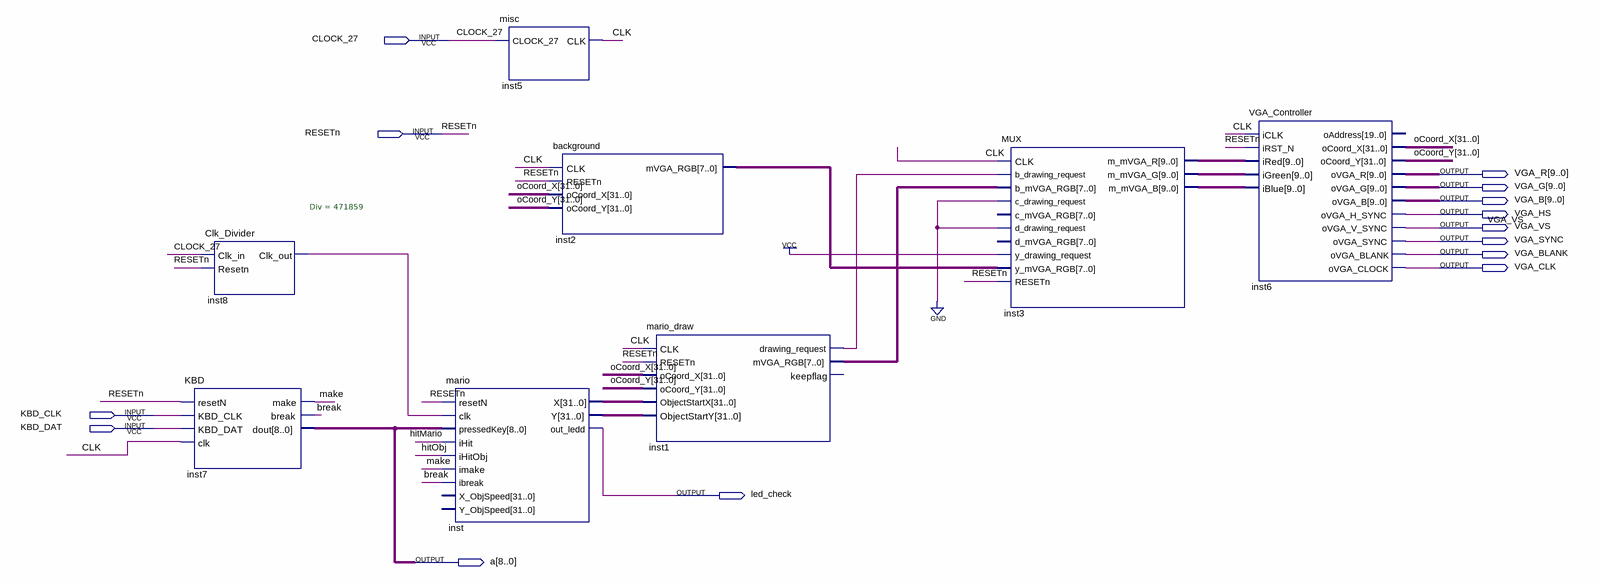
[diagram p0: schematic sheet]
// Quartus schematic SIFTAH_SUPER_MARIO.bdf as structural Verilog: 8 symbols, 14 pins
module SIFTAH_SUPER_MARIO (
  input  CLOCK_27,
  input  RESETn,
  input  KBD_CLK,
  input  KBD_DAT,
  output [9:0] VGA_R,
  output [9:0] VGA_G,
  output [9:0] VGA_B,
  output VGA_HS,
  output VGA_VS,
  output VGA_SYNC,
  output VGA_BLANK,
  output VGA_CLK,
  output led_check,
  output [8:0] a
);

  wire \break , CLK, hitMario, hitObj, inst1_drawing_request, inst8_clk_out, make;
  wire [7:0] inst1_mvga_rgb, inst2_mvga_rgb;
  wire [9:0] inst3_m_mvga_b, inst3_m_mvga_g, inst3_m_mvga_r;
  wire [31:0] inst_x, inst_y, oCoord_X, oCoord_Y;

  KBD inst7 (
    .resetN(RESETn), .KBD_CLK(KBD_CLK), .KBD_DAT(KBD_DAT), .clk(CLK), .make(make), .\break (\break ), .dout(a));
  Clk_Divider #(.Div(471859)) inst8 (.Clk_in(CLOCK_27), .Resetn(RESETn), .Clk_out(inst8_clk_out));
  mario inst (
    .resetN(RESETn), .clk(inst8_clk_out), .pressedKey(a), .iHit(hitMario), .iHitObj(hitObj), .imake(make),
    .ibreak(\break ), .X(inst_x), .Y(inst_y), .out_ledd(led_check));  // open: X_ObjSpeed, Y_ObjSpeed
  misc inst5 (.CLOCK_27(CLOCK_27), .CLK(CLK));
  background inst2 (.CLK(CLK), .RESETn(RESETn), .oCoord_X(oCoord_X), .oCoord_Y(oCoord_Y), .mVGA_RGB(inst2_mvga_rgb));
  mario_draw inst1 (
    .CLK(CLK), .RESETn(RESETn), .oCoord_X(oCoord_X), .oCoord_Y(oCoord_Y), .ObjectStartX(inst_x),
    .ObjectStartY(inst_y), .drawing_request(inst1_drawing_request), .mVGA_RGB(inst1_mvga_rgb));  // open: keepflag
  MUX inst3 (
    .CLK(CLK), .b_drawing_request(inst1_drawing_request), .b_mVGA_RGB(inst1_mvga_rgb),
    .c_drawing_request(1'b0), .d_drawing_request(1'b0), .y_drawing_request(1'b1),
    .y_mVGA_RGB(inst2_mvga_rgb), .RESETn(RESETn), .m_mVGA_R(inst3_m_mvga_r), .m_mVGA_G(inst3_m_mvga_g),
    .m_mVGA_B(inst3_m_mvga_b));  // open: c_mVGA_RGB, d_mVGA_RGB
  VGA_Controller inst6 (
    .iCLK(CLK), .iRST_N(RESETn), .iRed(inst3_m_mvga_r), .iGreen(inst3_m_mvga_g), .iBlue(inst3_m_mvga_b),
    .oCoord_X(oCoord_X), .oCoord_Y(oCoord_Y), .oVGA_R(VGA_R), .oVGA_G(VGA_G), .oVGA_B(VGA_B),
    .oVGA_H_SYNC(VGA_HS), .oVGA_V_SYNC(VGA_VS), .oVGA_SYNC(VGA_SYNC), .oVGA_BLANK(VGA_BLANK),
    .oVGA_CLOCK(VGA_CLK));  // open: oAddress
endmodule
